# EAGLE design RocketDuino (EAGLE 7.6.0)
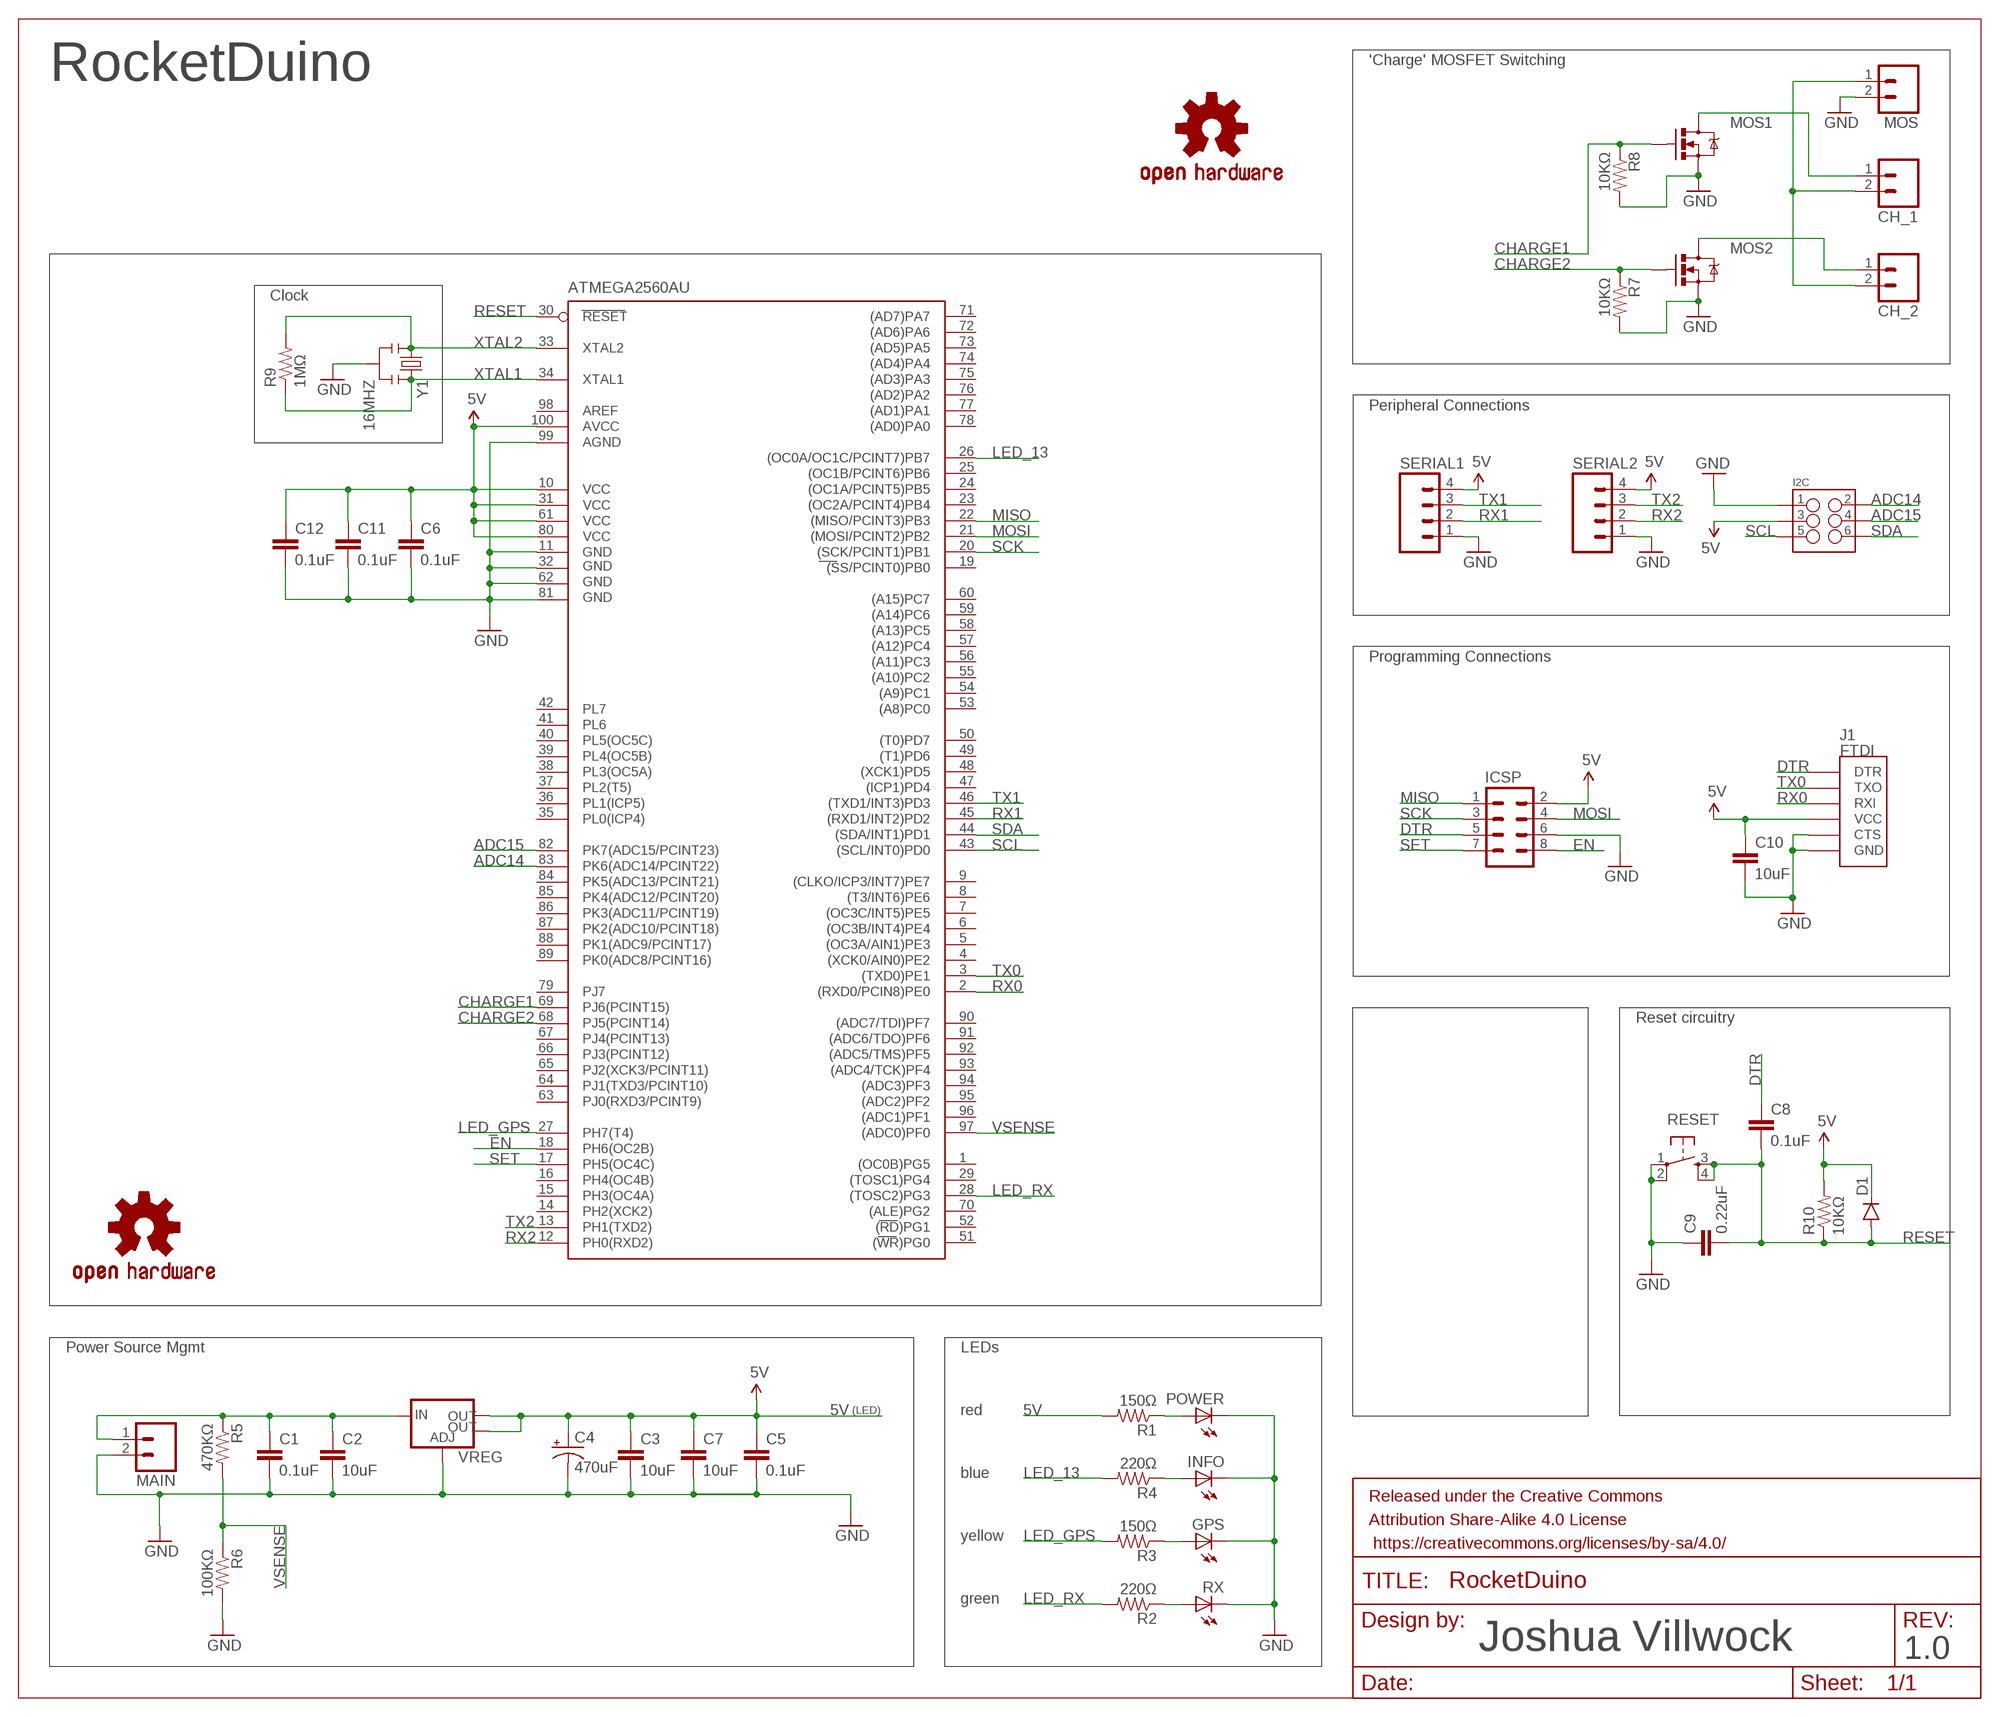
[diagram p0: schematic, sheet 1]

## Parts
ATMEGA2560AU  ATMEGA2560AU  [TQFP100]
C1  0.1uF  CAP1206  [1206]
C2  10uF  CAP1206  [1206]
C3  10uF  CAP1206  [1206]
C4  470uF  CAP_POLPTH1  [CPOL-RADIAL-100UF-25V]
C5  0.1uF  CAP1206  [1206]
C6  0.1uF  CAP1206  [1206]
C7  10uF  CAP1206  [1206]
C8  0.1uF  CAP1206  [1206]
C9  0.22uF  CAP1206  [1206]
C10  10uF  CAP1206  [1206]
C11  0.1uF  CAP1206  [1206]
C12  0.1uF  CAP1206  [1206]
CH_1  M02LOCK_LONGPADS  [1X02_LOCK_LONGPADS]
CH_2  M02LOCK_LONGPADS  [1X02_LOCK_LONGPADS]
D1  DIODESMA-ALT  [SMA-DIODE_ALT]
FRAME1  FRAME-LEDGER  [CREATIVE_COMMONS]
GPS  LEDSML0805  [SML0805]
I2C  M03X2FEMALE  [2X3]
ICSP  M04X2  [2X4]
INFO  LEDSML0805  [SML0805]
J1  FTDI  FTDI_DEVICE  [FTDI_DEVICE_SIDE]
LOGO1  OSHW-LOGOM  [OSHW-LOGO-M]
LOGO2  OSHW-LOGOM  [OSHW-LOGO-M]
MAIN  M02LOCK_LONGPADS  [1X02_LOCK_LONGPADS]
MOS  M02LOCK_LONGPADS  [1X02_LOCK_LONGPADS]
MOS1  MOSFET-NCHANNELFQP30N06L  [TO220V]
MOS2  MOSFET-NCHANNELFQP30N06L  [TO220V]
POWER  LEDSML0805  [SML0805]
R1  150Ω  RESISTOR1206  [1206]
R2  220Ω  RESISTOR1206  [1206]
R3  150Ω  RESISTOR1206  [1206]
R4  220Ω  RESISTOR1206  [1206]
R5  470KΩ  RESISTOR1206  [1206]
R6  100KΩ  RESISTOR1206  [1206]
R7  10KΩ  RESISTOR1206  [1206]
R8  10KΩ  RESISTOR1206  [1206]
R9  1MΩ  RESISTOR1206  [1206]
R10  10KΩ  RESISTOR1206  [1206]
RESET  SWITCH_SPST_4_PINSQUARE  [TACTILE-SWITCH-SMD]
RX  LEDSML0805  [SML0805]
SERIAL1  M04POLAR  [MOLEX-1X4]
SERIAL2  M04POLAR  [MOLEX-1X4]
VREG  V_REG_LM1117SOT223  [SOT223]
Y1  16MHZ  RESONATOR16MHZ  [RESONATOR-SMD]

## Nets
5V: ATMEGA2560AU.10(VCC) ATMEGA2560AU.31(VCC1) ATMEGA2560AU.61(VCC2) ATMEGA2560AU.80(VCC3) ATMEGA2560AU.100(AVCC) C3.1 C4.1(+) C5.1 C6.1 C7.1 C10.1 C11.1 C12.1 D1.C I2C.3 ICSP.2 J1.P$4(VCC) R1.2 R10.2 SERIAL1.4 SERIAL2.4 VREG.2(OUT) VREG.4(OUT)
ADC14: ATMEGA2560AU.83(PK6(ADC14/PCINT22)) I2C.2
ADC15: ATMEGA2560AU.82(PK7(ADC15/PCINT23)) I2C.4
CHARGE1: ATMEGA2560AU.69(PJ6(PCINT15)) MOS1.1(G) R8.1
CHARGE2: ATMEGA2560AU.68(PJ5(PCINT14)) MOS2.1(G) R7.1
DTR: C8.1 ICSP.5 J1.P$1(DTR)
EN: ATMEGA2560AU.18(PH6(OC2B)) ICSP.8
GND: ATMEGA2560AU.11(GND) ATMEGA2560AU.32(GND1) ATMEGA2560AU.62(GND2) ATMEGA2560AU.81(GND3) ATMEGA2560AU.99(AGND) C1.2 C2.2 C3.2 C4.2(-) C5.2 C6.2 C7.2 C9.1 C10.2 C11.2 C12.2 GPS.C I2C.1 ICSP.6 INFO.C J1.P$5(CTS) J1.P$6(GND) MAIN.2 MOS1.3(S) MOS2.3(S) MOS.2 POWER.C R6.2 R7.2 R8.2 RESET.1 RESET.2 RX.C SERIAL1.1 SERIAL2.1 VREG.1(ADJ) Y1.2
LED_13: ATMEGA2560AU.26((OC0A/OC1C/PCINT7)PB7) R4.2
LED_GPS: ATMEGA2560AU.27(PH7(T4)) R3.2
LED_RX: ATMEGA2560AU.28((TOSC2)PG3) R2.2
MISO: ATMEGA2560AU.22((MISO/PCINT3)PB3) ICSP.1
MOS1: CH_1.1 MOS1.2(D)
MOS2: CH_2.1 MOS2.2(D)
MOSI: ATMEGA2560AU.21((MOSI/PCINT2)PB2) ICSP.4
N$1: GPS.A R3.1
N$2: POWER.A R1.1
N$3: INFO.A R4.1
N$4: R2.1 RX.A
RESET: ATMEGA2560AU.30(RESET) C8.2 C9.2 D1.A R10.1 RESET.3 RESET.4
RX0: ATMEGA2560AU.2((RXD0/PCIN8)PE0) J1.P$3(RXI)
RX1: ATMEGA2560AU.45((RXD1/INT2)PD2) SERIAL1.2
RX2: ATMEGA2560AU.12(PH0(RXD2)) SERIAL2.2
SCK: ATMEGA2560AU.20((SCK/PCINT1)PB1) ICSP.3
SCL: ATMEGA2560AU.43((SCL/INT0)PD0) I2C.5
SDA: ATMEGA2560AU.44((SDA/INT1)PD1) I2C.6
SET: ATMEGA2560AU.17(PH5(OC4C)) ICSP.7
TX0: ATMEGA2560AU.3((TXD0)PE1) J1.P$2(TXO)
TX1: ATMEGA2560AU.46((TXD1/INT3)PD3) SERIAL1.3
TX2: ATMEGA2560AU.13(PH1(TXD2)) SERIAL2.3
VIN: C1.1 C2.1 MAIN.1 R5.1 VREG.3(IN)
VIN_MOS: CH_1.2 CH_2.2 MOS.1
VSENSE: ATMEGA2560AU.97((ADC0)PF0) R5.2 R6.1
XTAL1: ATMEGA2560AU.34(XTAL1) R9.1 Y1.3
XTAL2: ATMEGA2560AU.33(XTAL2) R9.2 Y1.1
Unconnected: ATMEGA2560AU.1((OC0B)PG5) ATMEGA2560AU.4((XCK0/AIN0)PE2) ATMEGA2560AU.5((OC3A/AIN1)PE3) ATMEGA2560AU.6((OC3B/INT4)PE4) ATMEGA2560AU.7((OC3C/INT5)PE5) ATMEGA2560AU.8((T3/INT6)PE6) ATMEGA2560AU.9((CLKO/ICP3/INT7)PE7) ATMEGA2560AU.14(PH2(XCK2)) ATMEGA2560AU.15(PH3(OC4A)) ATMEGA2560AU.16(PH4(OC4B)) ATMEGA2560AU.19((SS/PCINT0)PB0) ATMEGA2560AU.23((OC2A/PCINT4)PB4) ATMEGA2560AU.24((OC1A/PCINT5)PB5) ATMEGA2560AU.25((OC1B/PCINT6)PB6) ATMEGA2560AU.29((TOSC1)PG4) ATMEGA2560AU.35(PL0(ICP4)) ATMEGA2560AU.36(PL1(ICP5)) ATMEGA2560AU.37(PL2(T5)) ATMEGA2560AU.38(PL3(OC5A)) ATMEGA2560AU.39(PL4(OC5B)) ATMEGA2560AU.40(PL5(OC5C)) ATMEGA2560AU.41(PL6) ATMEGA2560AU.42(PL7) ATMEGA2560AU.47((ICP1)PD4) ATMEGA2560AU.48((XCK1)PD5) ATMEGA2560AU.49((T1)PD6) ATMEGA2560AU.50((T0)PD7) ATMEGA2560AU.51((WR)PG0) ATMEGA2560AU.52((RD)PG1) ATMEGA2560AU.53((A8)PC0) ATMEGA2560AU.54((A9)PC1) ATMEGA2560AU.55((A10)PC2) ATMEGA2560AU.56((A11)PC3) ATMEGA2560AU.57((A12)PC4) ATMEGA2560AU.58((A13)PC5) ATMEGA2560AU.59((A14)PC6) ATMEGA2560AU.60((A15)PC7) ATMEGA2560AU.63(PJ0(RXD3/PCINT9)) ATMEGA2560AU.64(PJ1(TXD3/PCINT10)) ATMEGA2560AU.65(PJ2(XCK3/PCINT11)) ATMEGA2560AU.66(PJ3(PCINT12)) ATMEGA2560AU.67(PJ4(PCINT13)) ATMEGA2560AU.70((ALE)PG2) ATMEGA2560AU.71((AD7)PA7) ATMEGA2560AU.72((AD6)PA6) ATMEGA2560AU.73((AD5)PA5) ATMEGA2560AU.74((AD4)PA4) ATMEGA2560AU.75((AD3)PA3) ATMEGA2560AU.76((AD2)PA2) ATMEGA2560AU.77((AD1)PA1) ATMEGA2560AU.78((AD0)PA0) ATMEGA2560AU.79(PJ7) ATMEGA2560AU.84(PK5(ADC13/PCINT21)) ATMEGA2560AU.85(PK4(ADC12/PCINT20)) ATMEGA2560AU.86(PK3(ADC11/PCINT19)) ATMEGA2560AU.87(PK2(ADC10/PCINT18)) ATMEGA2560AU.88(PK1(ADC9/PCINT17)) ATMEGA2560AU.89(PK0(ADC8/PCINT16)) ATMEGA2560AU.90((ADC7/TDI)PF7) ATMEGA2560AU.91((ADC6/TDO)PF6) ATMEGA2560AU.92((ADC5/TMS)PF5) ATMEGA2560AU.93((ADC4/TCK)PF4) ATMEGA2560AU.94((ADC3)PF3) ATMEGA2560AU.95((ADC2)PF2) ATMEGA2560AU.96((ADC1)PF1) ATMEGA2560AU.98(AREF)

## Notes on the sheet
- 'Charge' MOSFET Switching
- RocketDuino
- Clock
- Peripheral Connections
- Programming Connections
- Reset circuitry
- Power Source Mgmt | LEDs
- (LED) | red
- blue
- yellow
- green
- Joshua Villwock | 1.0

## Library data of the parts
ATMEGA2560AU = SparkFun-DigitalIC:ATMEGA2560: Atmel 100-pin 8-bit uC 64/128/256 Kbytes FLASH 4 Kbytes EEPROM 8 Kbytes SRAM 86 General Purpose I/O pins 12-channels16-bit PWM 4 x Serial USARTs 16-channels 10-bit A/D; PROD_ID: IC-10040
C1-C3 C5-C12 = SparkFun-Capacitors:CAP: Capacitor Standard 0603 ceramic capacitor, and 0.1" leaded capacitor.
C4 = SparkFun-Capacitors:CAP_POL: Capacitor Polarized These are standard SMD and PTH capacitors. Normally 10uF, 47uF, and 100uF in electrolytic and tantalum varieties. Always verify the external diameter of the through hole cap, it varies with capacity, voltage, and manufacturer. The EIA devices should be standard.
CH_1 CH_2 MAIN MOS = SparkFun-Connectors:M02: Standard 2-pin 0.1" header. Use with - straight break away headers ( PRT-00116) - right angle break away headers (PRT-00553) - swiss pins (PRT-00743) - machine pins (PRT-00117) - female headers (PRT-00115) Molex polarized connector foot print use with: PRT-08233 with associated crimp pins and housings. 2.54_SCREWTERM for use with PRT-10571. 3.5mm Screw Terminal footprints for PRT-08084 5mm Screw Terminal footprints for use with PRT-08432
D1 = SparkFun-DiscreteSemi:DIODE: Diode These are standard reverse protection diodes and small signal diodes. SMA package can handle up to about 1A. SOD-323 can handle about 200mA. What the SOD-323 package when ordering, there are some mfgs out there that are 5-pin packages.
FRAME1 = SparkFun-Aesthetics:FRAME-LEDGER: Schematic Frame Standard 11x14 US Ledger frame
GPS INFO POWER RX = led:LED: LED OSRAM: - CHIPLED LG R971, LG N971, LY N971, LG Q971, LY Q971, LO R971, LY R971 LH N974, LH R974 LS Q976, LO Q976, LY Q976 LO Q996 - Hyper CHIPLED LW Q18S LB Q993, LB Q99A, LB R99A - SideLED LS A670, LO A670, LY A670, LG A670, LP A670 LB A673, LV A673, LT A673, LW A673 LH A674 LY A675 LS A676, LA A676, LO A676, LY A676, LW A676 LS A679, LY A679, LG A679 - Hyper Micro SIDELED® LS Y876, LA Y876, LO Y876, LY Y876 LT Y87S - SmartLED LW L88C, LW L88S LB L89C, LB L89S, LG L890 LS L89K, LO L89K, LY L89K LS L896, LA L896, LO L896, LY L896 - TOPLED LS T670, LO T670, LY T670, LG T670, LP T670 LSG T670, LSP T670, LSY T670, LOP T670, LYG T670 LG T671, LOG T671, LSG T671 LB T673, LV T673, LT T673, LW T673 LH T674 LS T676, LA T676, LO T676, LY T676, LB T676, LH T676, LSB T676, LW T676 LB T67C, LV T67C, LT T67C, LS T67K, LO T67K, LY T67K, LW E67C LS E67B, LA E67B, LO E67B, LY E67B, LB E67C, LV E67C, LT E67C LW T67C LS T679, LY T679, LG T679 LS T770, LO T770, LY T770, LG T770, LP T770 LB T773, LV T773, LT T773, LW T773 LH T774 LS E675, LA E675, LY E675, LS T675 LS T776, LA T776, LO T776, LY T776, LB T776 LHGB T686 LT T68C, LB T68C - Hyper Mini TOPLED® LB M676 - Mini TOPLED Santana® LG M470 LS M47K, LO M47K, LY M47K Source: http://www.osram.convergy.de LUXEON: - LUMILED® LXK2-PW12-R00, LXK2-PW12-S00, LXK2-PW14-U00, LXK2-PW14-V00 LXK2-PM12-R00, LXK2-PM12-S00, LXK2-PM14-U00 LXK2-PE12-Q00, LXK2-PE12-R00, LXK2-PE12-S00, LXK2-PE14-T00, LXK2-PE14-U00 LXK2-PB12-K00, LXK2-PB12-L00, LXK2-PB12-M00, LXK2-PB14-N00, LXK2-PB14-P00, LXK2-PB14-Q00 LXK2-PR12-L00, LXK2-PR12-M00, LXK2-PR14-Q00, LXK2-PR14-R00 LXK2-PD12-Q00, LXK2-PD12-R00, LXK2-PD12-S00 LXK2-PH12-R00, LXK2-PH12-S00 LXK2-PL12-P00, LXK2-PL12-Q00, LXK2-PL12-R00 Source: www.luxeon.com KINGBRIGHT: KA-3528ASYC Source: www.kingbright.com
I2C = SparkFun-Connectors:M03X2: 2x3 .1" header. Shrouded, with keying- CONN-10681 SMT- CONN-11415 Pogo pins- HW-11044; PROD_ID: CONN-11566; VALUE: FEMALE 2x3
ICSP = SparkFun-Connectors:M04X2: .1" header, two rows of four.
J1 = SparkFun-Connectors:FTDI_DEVICE: Connector which mates to FTDI basic or FTDI cable.
LOGO1 LOGO2 = SparkFun-Aesthetics:OSHW-LOGO: Open Source Hardware Logo This logo indicates the piece of hardware it is found on incorporates a OSHW license and/or adheres to the definition of open source hardware found here: http://freedomdefined.org/OSHW
MOS1 MOS2 = SparkFun-DiscreteSemi:MOSFET-NCHANNEL: Common NMOSFET Parts MFG P/N Store ID Prod ID FDD8780 TRANS-09984 SI7820DN TRANS-11055 FDS6630A IC-08089 2N7002PW TRANS-11151 FQP30N06L COM-10213 TRANS-10060 BSS123LT1G TRANS-08345 BSS138 TRANS-00830 BS170 2N7000; PROD_ID: TRANS-10060
R1-R10 = SparkFun-Resistors:RESISTOR: Resistor Basic schematic elements and footprints for 0603, 1206, and PTH resistors.
RESET = SparkFun-Electromechanical:SWITCH_SPST_4_PIN; PROD_ID: SWCH-08247
SERIAL1 SERIAL2 = SparkFun-Connectors:M04: Header 4 Standard 4-pin 0.1" header. Use with straight break away headers (SKU : PRT-00116), right angle break away headers (PRT-00553), swiss pins (PRT-00743), machine pins (PRT-00117), and female headers (PRT-00115). Molex polarized connector foot print use with SKU : PRT-08231 with associated crimp pins and housings. 1MM SMD Version SKU: PRT-10208
VREG = SparkFun-PowerIC:V_REG_LM1117: Voltage Regulator LM1117 Standard adjustable voltage regulator but in SMD form. Spark Fun Electronics SKU : COM-00595; PROD_ID: VREG-08170
Y1 = SparkFun-FreqCtrl:RESONATOR: Resonator Small SMD resonator. Used, eg, on the Arduino Pro/ Pro Mini boards. 8MHz- XTAL-08895 16MHz- XTAL-08900; PROD_ID: XTAL-08900

## Board
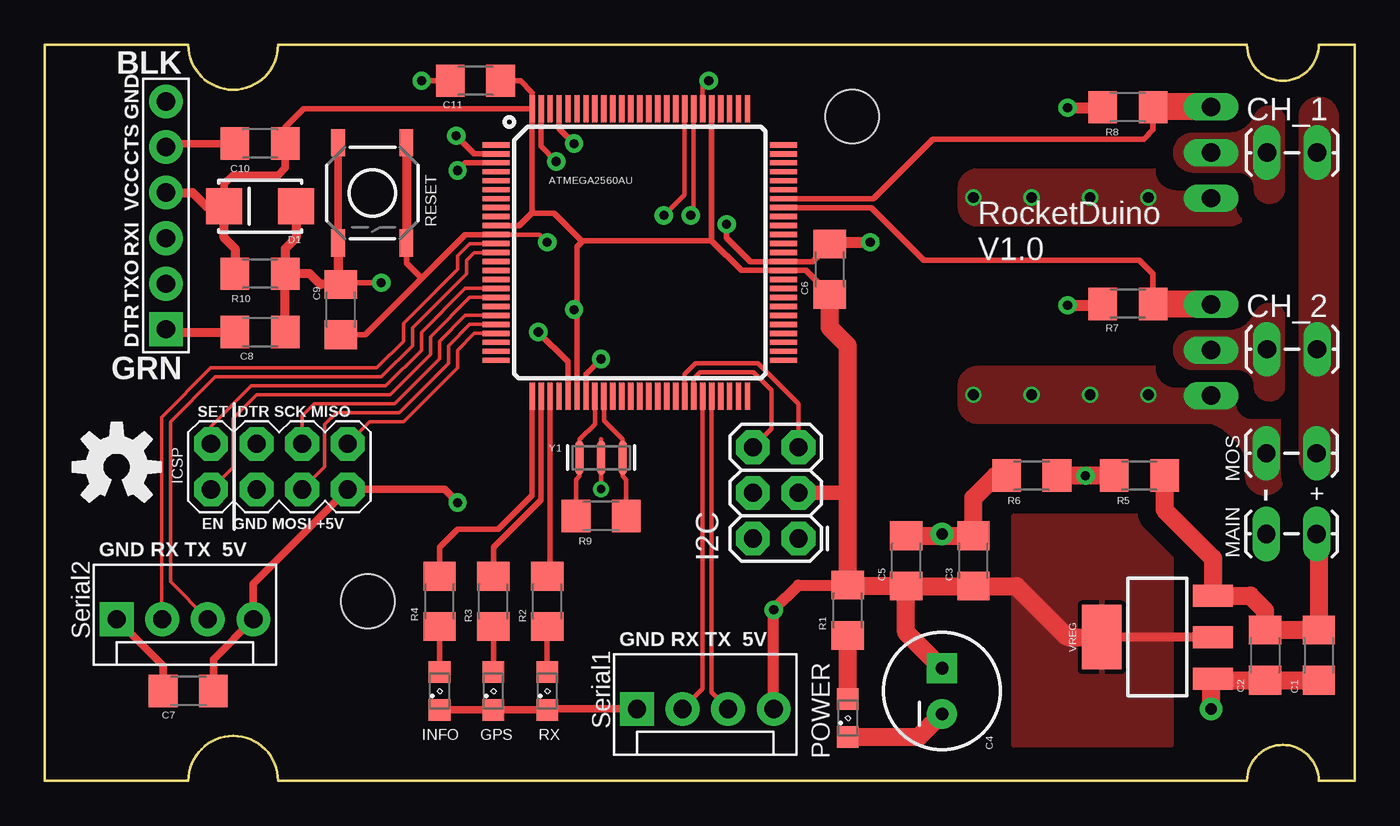
[diagram p1: board, top side]
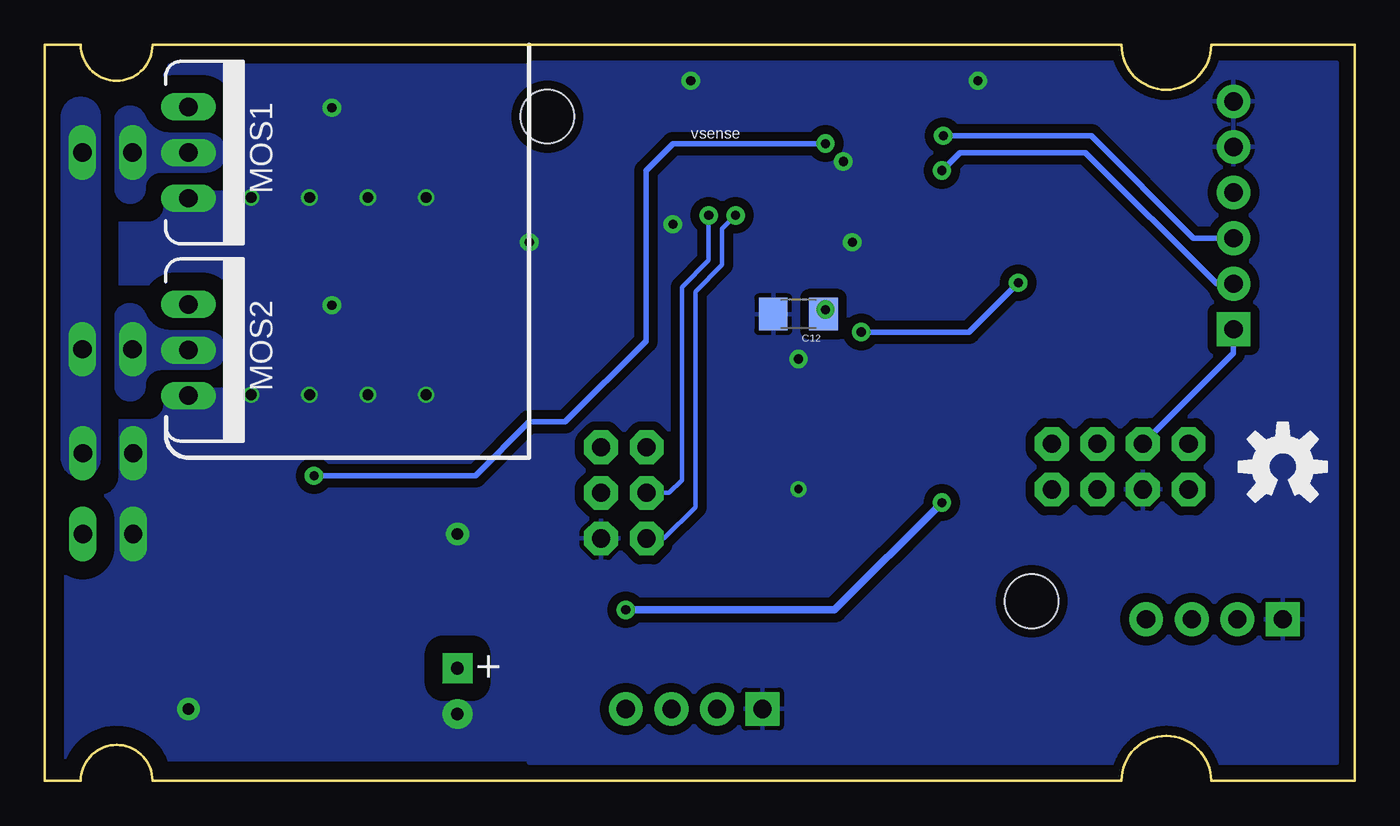
[diagram p2: board, bottom side, seen from below]

Size 73 x 41 mm. Coordinates in mm from the lower left corner, seen from the top.
Outline: 8,41 0,41 0,0 8,0 arc-180 13,0 67,0 arc-90 69,2 arc-90 71,0 73,0 73,41 71,41 arc-90 69,39 arc-90 67,41 13,41 arc-180 8,41
Copper layers (1*16): Top 0.035mm / dielectric 1.5mm / Bottom 0.035mm
Design rules "MakerStudio": minimum track width 6mil, minimum drill 12mil, track to track 6mil, track to pad 6mil, pad to pad 6mil, via to via 6mil, smd to smd 0mil, copper to edge 10mil, drill to drill 10mil, minimum pad ring 10mil, minimum via ring 6mil, stop-mask expansion 2mil, vias tented up to drill 100mil, thermal gap 10mil
Holes 3 mm at 45,37 18,10

### Footprints (pad centres in the part's own frame; a part is rotated, then mirrored left to right if it is on the bottom)
TQFP100 = smd 1.5 x 0.3: 1 -8,6; 2 -8,5.5; 3 -8,5; 4 -8,4.5; 5 -8,4; 6 -8,3.5; 7 -8,3; 8 -8,2.5; 9 -8,2; 10 -8,1.5; 11 -8,1; 12 -8,0.5; 13 -8,0; 14 -8,-0.5; 15 -8,-1; 16 -8,-1.5; 17 -8,-2; 18 -8,-2.5; 19 -8,-3; 20 -8,-3.5; 21 -8,-4; 22 -8,-4.5; 23 -8,-5; 24 -8,-5.5; 25 -8,-6; 51 8,-6; 52 8,-5.5; 53 8,-5; 54 8,-4.5; 55 8,-4; 56 8,-3.5; 57 8,-3; 58 8,-2.5; 59 8,-2; 60 8,-1.5; 61 8,-1; 62 8,-0.5; 63 8,0; 64 8,0.5; 65 8,1; 66 8,1.5; 67 8,2; 68 8,2.5; 69 8,3; 70 8,3.5; 71 8,4; 72 8,4.5; 73 8,5; 74 8,5.5; 75 8,6 | smd 0.3 x 1.5: 26 -6,-8; 27 -5.5,-8; 28 -5,-8; 29 -4.5,-8; 30 -4,-8; 31 -3.5,-8; 32 -3,-8; 33 -2.5,-8; 34 -2,-8; 35 -1.5,-8; 36 -1,-8; 37 -0.5,-8; 38 0,-8; 39 0.5,-8; 40 1,-8; 41 1.5,-8; 42 2,-8; 43 2.5,-8; 44 3,-8; 45 3.5,-8; 46 4,-8; 47 4.5,-8; 48 5,-8; 49 5.5,-8; 50 6,-8; 76 6,8; 77 5.5,8; 78 5,8; 79 4.5,8; 80 4,8; 81 3.5,8; 82 3,8; 83 2.5,8; 84 2,8; 85 1.5,8; 86 1,8; 87 0.5,8; 88 0,8; 89 -0.5,8; 90 -1,8; 91 -1.5,8; 92 -2,8; 93 -2.5,8; 94 -3,8; 95 -3.5,8; 96 -4,8; 97 -4.5,8; 98 -5,8; 99 -5.5,8; 100 -6,8
1206 = smd 1.6 x 1.8: 1 -1.4,0; 2 1.4,0
CPOL-RADIAL-100UF-25V = drill 0.7 pad 1.651 square: 1 1.27,0 | drill 0.7 pad 1.651: 2 -1.27,0
1X02_LOCK_LONGPADS = drill 1.016 long: 1 -0.127,0; 2 2.667,0
SMA-DIODE_ALT = smd 2 x 2: A -2,0; C 2,0
SML0805 = smd 1.2 x 1.2: A 1.05,0; C -1.05,0
2X3 = drill 1.016 pad 1.88 octagon: 1 0,0; 2 0,2.54; 3 2.54,0; 4 2.54,2.54; 5 5.08,0; 6 5.08,2.54
2X4 = drill 1.016 pad 1.88 octagon: 1 -3.81,-1.27; 2 -3.81,1.27; 3 -1.27,-1.27; 4 -1.27,1.27; 5 1.27,-1.27; 6 1.27,1.27; 7 3.81,-1.27; 8 3.81,1.27
FTDI_DEVICE_SIDE = drill 1.016 pad 1.88 square: P$1 -6.35,0 | drill 1.016 pad 1.88: P$2 -3.81,0; P$3 -1.27,0; P$4 1.27,0; P$5 3.81,0; P$6 6.35,0
TO220V = drill 1.016 long: 1 -2.54,0; 2 0,0; 3 2.54,0
TACTILE-SWITCH-SMD = smd 1.524 x 0.762: 1 -2.794,1.905; 2 2.794,1.905; 3 -2.794,-1.905; 4 2.794,-1.905
MOLEX-1X4 = drill 1.016 pad 1.88 square: 1 0,0 | drill 1.016 pad 1.88: 2 2.54,0; 3 5.08,0; 4 7.62,0
SOT223 = smd 1.219 x 2.235: 1 -2.311,-3.099; 2 0,-3.099; 3 2.311,-3.099 | smd 3.6 x 2.2: 4 0,3.099
RESONATOR-SMD = smd 0.45 x 1.905: 1 -1.2,0; 2 0,0; 3 1.2,0

### Placement (x,y rotation side)
ATMEGA2560AU  33.16,29.43 0 top
C1  71,7 270 top
C2  68,7 270 top
C3  51.75,12.25 90 top
C4  50,5 90 top
C5  48,12.25 90 top
C6  43.75,28.5 90 top
C7  8,5 180 top
C8  12,25 0 top
C9  16.5,26.25 90 top
C10  12,35.5 180 top
C11  24,39 180 top
C12  31,26 180 bottom
CH_1  68.24,35 0 top
CH_2  68.24,24.04 0 top
D1  12,32 180 top
FRAME1  21,-8 0 top  (outside the outline)
GPS  25,5 90 top
I2C  42,13.5 90 top
ICSP  13.07,17.5 180 top
INFO  22,5 90 top
J1  6.75,31.5 90 top
LOGO1  4,17.48 0 top
LOGO2  4,17.5 0 bottom
MAIN  70.75,13.75 180 top
MOS  70.75,18.25 180 top
MOS1  65,35 270 bottom
MOS2  65,24 270 bottom
POWER  44.75,3.5 90 top
R1  44.75,9.5 90 top
R2  28,10 90 top
R3  25,10 90 top
R4  22,10 90 top
R5  61,17 180 top
R6  55,17 180 top
R7  60.36,26.57 180 top
R8  60.36,37.53 180 top
R9  31,14.75 180 top
R10  12,28.25 180 top
RESET  18.25,32.75 270 top
RX  28,5 90 top
SERIAL1  33,4 0 top
SERIAL2  4,9 0 top
VREG  62,8 90 top
Y1  31,18 0 top

### Tracks (layer width: path | path; a pad name or v marks a point on that pad's centre or on a via)
5V  (via drill 0.51 pad 1.02)
  Top 0.254: 27.16,31.66 27.12,31.62 | 29.91,30.09 30,30.09 | 43.75,27.25 C6.1
  Top 0.305: ATMEGA2560AU.10 26.43,30.93 27.12,31.62 28.38,31.62 29.91,30.09 | ATMEGA2560AU.80 37.16,30.09 | 37.16,30.09 38.82,28.43 ATMEGA2560AU.61 42.42,28.43 C6.1 | 37.16,30.09 30,30.09 29.66,29.75 29.66,26.09 | ATMEGA2560AU.31 29.66,26.09 | 27.16,31.66 ATMEGA2560AU.100 | 27.16,37.25 ATMEGA2560AU.100 | ATMEGA2560AU.100 14.43,37.43 13.4,36.4 C10.1 | C11.1 26.5,39 27.16,38.34 ATMEGA2560AU.100 | v29.5,26.25 29.66,26.09
  Top 0.406: D1.C 10,33.25 10.5,33.75 13,33.75 13.4,34.15 C10.1 | v23,15.5 22.27,16.23 ICSP.2 11.62,10.97 SERIAL2.4 9.4,6.78 C7.1
  Top 0.508: VREG.2 VREG.4 | J1.P$4 8.23,32.77 9,32 D1.C 10,30.25 10.6,29.65 R10.2
  Top 0.61: R1.2 42,10.9 v40.62,9.52 SERIAL1.4
  Top 0.813: I2C.3 44.75,16.04 44.75,16
  Top 1: C5.1 C3.1
  Top 1.016: C4.1 48,8.27 C5.1 44.8,10.85 R1.2 44.75,16 44.75,24.25 43.75,25.25 C6.1 | C3.1 54.15,10.85 57,8 VREG.4
  Bottom 0.305: C12.1 29.5,26.1 v29.5,26.25
  Bottom 0.406: v23,15.5 28.98,9.52 v40.62,9.52
  pour Top (isolate 1.016): 54,14.75 54,2 62.75,2 62.75,14.75
ADC14  (via drill 0.51 pad 1.02)
  Top 0.254: ATMEGA2560AU.83 35.66,32.66 v34.5,31.5
  Bottom 0.254: I2C.2 38.5,13.5 36.75,15.25 36.75,27.25 35.25,28.75 35.25,30.75 v34.5,31.5
ADC15  (via drill 0.51 pad 1.02)
  Top 0.254: ATMEGA2560AU.82 36.16,31.66 v36,31.5
  Bottom 0.254: v36,31.5 36,29 37.5,27.5 37.5,16.75 38.21,16.04 I2C.4
CHARGE1
  Top 0.305: R8.1 61.76,36.26 61.25,35.75 49.5,35.75 46.18,32.43 ATMEGA2560AU.69
  Top 1.5: MOS1.1 R8.1
CHARGE2
  Top 0.305: ATMEGA2560AU.68 46.07,31.93 49,29 61,29 61.76,28.24 R7.1
  Top 1.5: MOS2.1 61.76,26.54 R7.1
DTR
  Top 0.406: 10.53,24.93 C8.1
  Top 0.508: J1.P$1 6.9,25 C8.1
  Bottom 0.3: ICSP.5 6.75,23.82 J1.P$1
EN
  Top 0.2: ATMEGA2560AU.18 23.68,26.93 21.5,24.75 21.5,23.75 19.25,21.5 11.8,21.5 10.5,20.2 10.5,17.47 ICSP.8
GND  (via drill 0.46 pad 0.89, 0.51 pad 1.02, 0.6, 0.64 pad 1.27)
  Top 0.254: ATMEGA2560AU.11 27.57,30.43 v28,30 | 31,16.98 v31,16.25 | ATMEGA2560AU.81 36.66,38.66 v37,39
  Top 0.3: v31,23.5 30.16,22.66 ATMEGA2560AU.32
  Top 0.305: ATMEGA2560AU.99 27.66,35.34 v28.5,34.5 | C6.2 42.78,28.93 ATMEGA2560AU.62 39.32,28.93 38,30.25 v38,31 | ATMEGA2560AU.11 23.43,30.43 21,28 | 21,28 17.85,24.85 C9.1 | C11.2 v21,39 | RESET.2 20.16,28.84 21,28
  Top 0.406: INFO.C GPS.C RX.C 28.05,4 SERIAL1.1 | J1.P$5 6.94,35.5 C10.2 | SERIAL2.1 6.6,6.4 C7.2 | v50,13.75 50,13.65
  Top 0.508: RESET.1 RESET.2
  Top 0.61: C6.2 43.85,30 v46,30 | v57,37.5 58.96,37.5 | v57,26.5 58.96,26.5
  Top 1: C2.2 C1.2 | C3.2 51.75,15.75 53,17 R6.2 | POWER.C 48.72,2.45 C4.2
  Top 1.016: 58.96,37.5 R8.2 | 58.96,26.5 R7.2 | C5.2 50,13.65 C3.2 | C2.2 65.19,5.6 VREG.1 65,5.59 v65,4
  other vias: 55,21.5 51.75,21.5 58.25,32.5 61.5,32.5 55,32.5 51.75,32.5 61.5,21.5 58.25,21.5
  pour Bottom (isolate 1.016, rank 2, no thermals): 48,40 59,40 arc-90 60,39 60,34 arc90 61,33 66,33 arc-180 66,31 61,31 arc90 60,30 60,23 arc90 61,22 66,22 arc-180 66,20 61,20 arc53 60,19.5 arc-53 59,19 48,19 arc-90 47,20 47,39 arc-90
  pour Bottom (isolate 1, rank 4, no thermals): 46,41 46,0 73,0 73,41
  pour Bottom (isolate 0.5): 1,40 46,40 46,1 1,1
  pour Bottom (isolate 0.5): 46,40 60,19 60,14 46,14
  pour Top (isolate 1, rank 4, no thermals): 52,34 66,34 arc-90 67,33 67,32 arc-90 66,31 52,31 arc-90 51,32 51,33 arc-90
  pour Top (isolate 1, rank 4, no thermals): 52,23 66,23 arc-90 67,22 67,21 arc-90 66,20 52,20 arc-90 51,21 51,22 arc-90
  pour Top (isolate 1, rank 4, no thermals): 62,20 63,20 arc-90 67,18 67,17 arc90 68,16 arc90 69,17 69,20 arc90 63,22 62,22
LED_13
  Top 0.3: 22,12.5 R4.2
  Top 0.305: ATMEGA2560AU.26 27.16,15.91 25.25,14 23,14 22,13 22,12.5
LED_GPS
  Top 0.305: ATMEGA2560AU.27 27.66,15.66 25,13 R3.2
LED_RX
  Top 0.305: ATMEGA2560AU.28 28.16,11.56 R2.2
MISO
  Top 0.2: ATMEGA2560AU.22 23.93,24.93 23,24 23,23 20,20 18.11,20 ICSP.1
MOS1
  pour Bottom (no thermals): 64,36 66,36 arc67 67.5,37 arc-135 69,37 69,33 arc-180 67.5,33 arc90 66.5,34 64,34 arc-90 63,35 arc-90
  pour Top (no thermals): 64,36 66,36 arc67 67.5,37 arc-135 69,37 69,33 arc-180 67.5,33 arc90 66.5,34 64,34 arc-90 63,35 arc-90
MOS2
  pour Top (no thermals): 64,25 66,25 arc67 67.5,26 arc-135 69,26 69,22 arc-180 67.5,22 arc90 66.5,23 64,23 arc-90 63,24 arc-90
  pour Bottom (isolate 0.254, no thermals): 64,25 66,25 arc67 67.5,26 arc-135 69,26 69,22 arc-180 67.5,22 arc90 66.5,23 64,23 arc-90 63,24 arc-90
MOSI
  Top 0.2: ATMEGA2560AU.21 23.68,25.43 22.5,24.25 22.5,23.25 19.75,20.5 16.25,20.5 15.6,19.85 15.6,17.49 ICSP.4
N$1
  Top 0.3: R3.1 GPS.A
N$2
  Top 1.016: POWER.A R1.1
N$3
  Top 0.3: R4.1 INFO.A
N$4
  Top 0.3: R2.1 RX.A
RESET  (via drill 0.51 pad 1.02)
  Top 0.305: v18.75,27.75 16.6,27.75 C9.2 | v27.5,25 29.16,23.34 ATMEGA2560AU.30
  Top 0.406: RESET.3 RESET.4
  Top 0.508: C8.2 R10.1 | D1.A 14,31.5 | 14,31.5 14,30.25 13.4,29.65 R10.1 | 16.29,30.71 RESET.4 16.34,27.8 C9.2 15.35,27.65 14.75,28.25 R10.1 | 14,31.5 14.5,32
  Bottom 0.305: v18.75,27.75 21.5,25 v27.5,25
RX0  (via drill 0.51 pad 1.02)
  Top 0.305: ATMEGA2560AU.2 23.93,34.93 v22.93,35.93
  Bottom 0.305: J1.P$3 8.98,30.23 14.68,35.93 v22.93,35.93
RX1
  Top 0.254: ATMEGA2560AU.45 36.66,5.12 SERIAL1.2
RX2
  Top 0.203: ATMEGA2560AU.12 23.68,29.93 23,29.25 23,28.5 20,25.5 20,24.5 18.5,23 9.25,23 6.5,20.25 6.5,9.04 SERIAL2.2
SCK
  Top 0.2: ATMEGA2560AU.20 23.43,25.93 22,24.5 22,23.5 19.5,21 15,21 14.34,20.34 ICSP.3
SCL
  Top 0.254: ATMEGA2560AU.43 35.66,22.66 36.25,23.25 39.75,23.25 42,21 I2C.5
SDA
  Top 0.254: ATMEGA2560AU.44 36.16,22.41 36.5,22.75 39.5,22.75 40.5,21.75 40.5,19.62 I2C.6
SET
  Top 0.2: ATMEGA2560AU.17 23.43,27.43 21,25 21,24 19,22 11.5,22 9.26,19.76 ICSP.7
TX0  (via drill 0.51 pad 1.02)
  Top 0.305: ATMEGA2560AU.3 23.43,34.43 v23,34
  Bottom 0.305: J1.P$2 7.69,27.69 15,35 22,35 v23,34
TX1
  Top 0.254: ATMEGA2560AU.46 37.16,4.92 SERIAL1.3
TX2
  Top 0.203: ATMEGA2560AU.13 23.93,29.43 23.5,29 23.5,28.25 20.5,25.25 20.5,24.25 18.75,22.5 9.5,22.5 7,20 7,11.08 SERIAL2.3
VIN
  Top 1: C2.1 C1.1 70.75,8.65
  Top 1.016: R5.1 62.4,15.1 65.1,12.4 VREG.3 67.19,10.31 68,9.5 C2.1 | MAIN.1 71,13.63 C1.1
VIN_MOS
  pour Top (isolate 0.254, no thermals): 70,37 70,18 arc90 71,17 arc90 72,18 72,37 arc90 71,38 arc90
  pour Bottom (isolate 0.254, no thermals): 71,38 arc-90 72,37 72,18 arc-90 71,17 arc-90 70,18 70,37 arc-90
VSENSE  (via drill 0.51 pad 1.02)
  Top 0.305: ATMEGA2560AU.97 28.66,36.34 v29.5,35.5
  Top 1: R5.2 v58,17 R6.1
  Bottom 0.305: v58,17 49,17 46,20 44,20 39.5,24.5 39.5,34 38,35.5 v29.5,35.5
XTAL1
  Top 0.254: 32.2,16.98 32.4,16.78 R9.1 | 32.2,19.02 31.16,20.06 ATMEGA2560AU.34
XTAL2
  Top 0.254: 29.8,16.98 29.6,16.78 R9.2 | 29.8,19.02 30.66,19.88 ATMEGA2560AU.33

### Text on the board
tPlace: RocketDuino | V1.0 | SET DTR SCK MISO | - | + | EN GND MOSI +5V | Serial2 | GND RX TX 5V | GND RX TX 5V | Serial1
bPlace: vsense | +
Document: Joshua Villwock